# Altium schematic sheet ETH10M100M_RMII_LAN8720.SchDoc
size A3
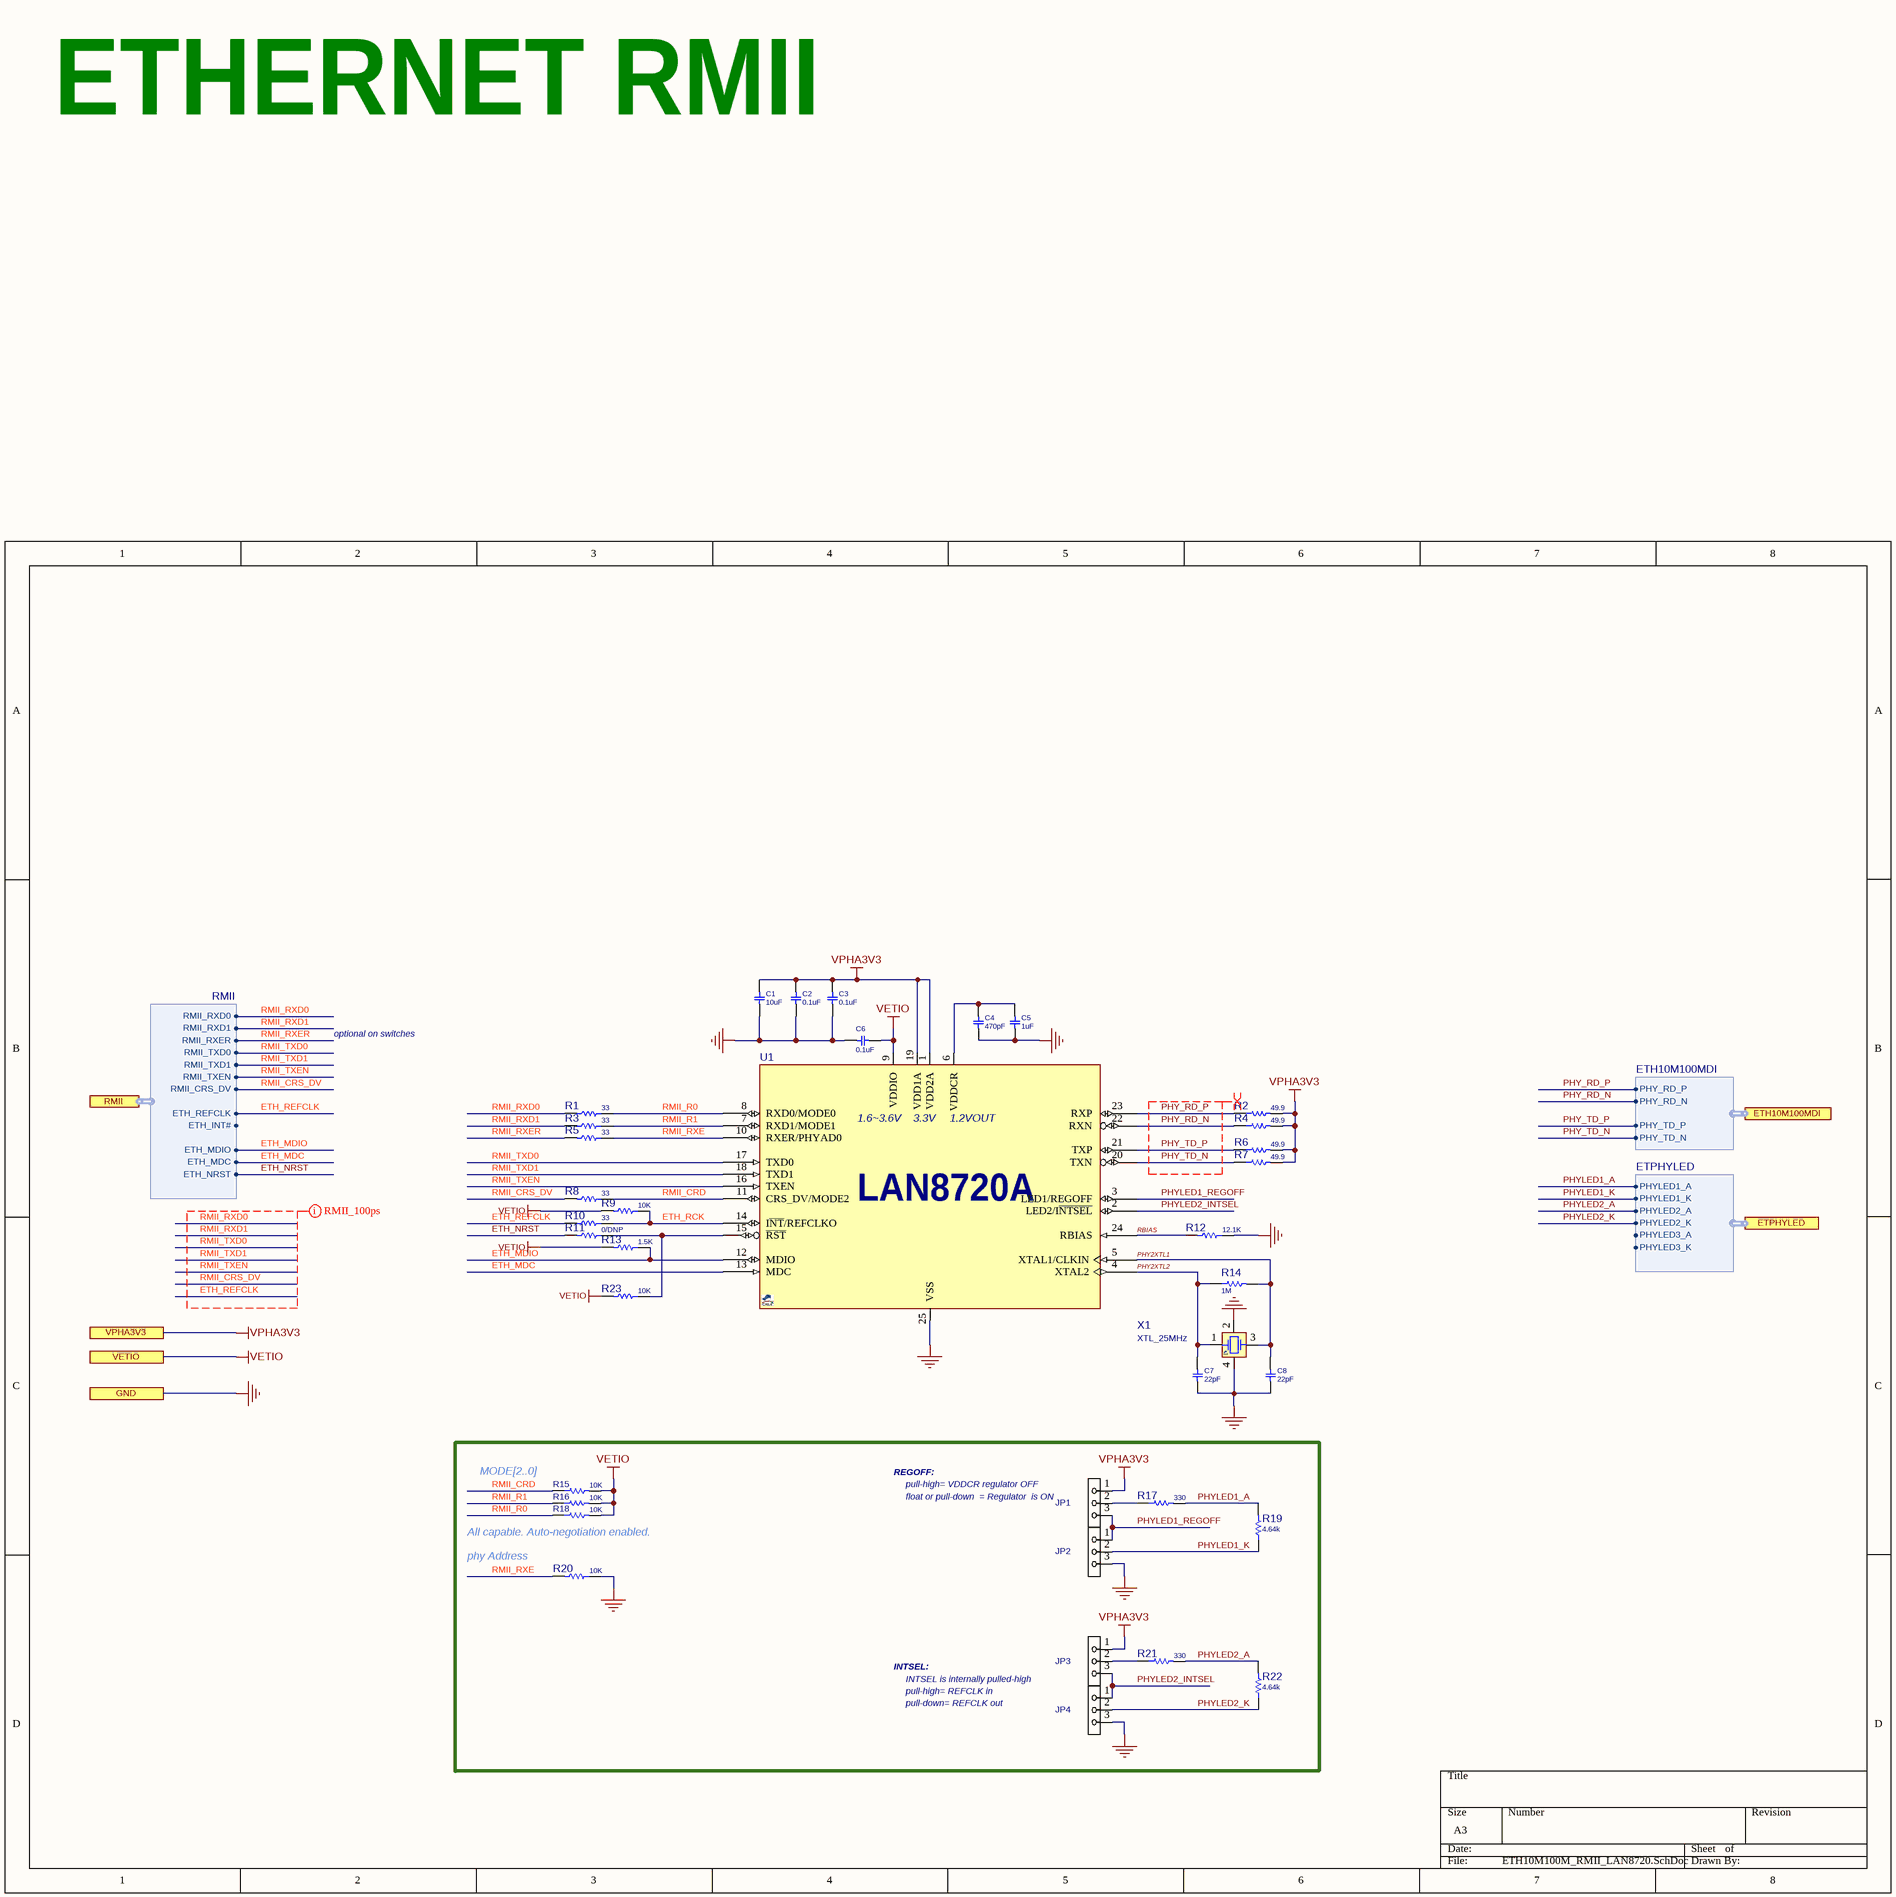
[diagram p0: ETH10M100M_RMII_LAN8720.SchDoc]

## Parts
C1  10uF  [C0402]
C2  0.1uF  [C0402]
C3  0.1uF  [C0402]
C4  470pF  [C0402]
C5  1uF  [C0402]
C6  0.1uF  [C0402]
C7  22pF  [C0402]
C8  22pF  [C0402]
JP1  JMPHDR3PIN  [JP_3_60W]  (value not drawn)
JP2  JMPHDR3PIN  [JP_3_60W]  (value not drawn)
JP3  JMPHDR3PIN  [JP_3_60W]  (value not drawn)
JP4  JMPHDR3PIN  [JP_3_60W]  (value not drawn)
R1  33  [R0402]
R2  49.9  [R0402]
R3  33  [R0402]
R4  49.9  [R0402]
R5  33  [R0402]
R6  49.9  [R0402]
R7  49.9  [R0402]
R8  33  [R0402]
R9  10K  [R0402]
R10  33  [R0402]
R11  0/DNP  [R0402]
R12  12.1K  [R0402]
R13  1.5K  [R0402]
R14  1M  [R0402]
R15  10K  [R0402]
R16  10K  [R0402]
R17  330  [R0402]
R18  10K  [R0402]
R19  4.64k  [R0402]
R20  10K  [R0402]
R21  330  [R0402]
R22  4.64k  [R0402]
R23  10K  [R0402]
U1  LAN8720A  [QFN50_24T]  (value not drawn)
X1  XTL_25MHz  [XTL_4_3225]

## Ports
ETH10M100MDI (harness ETH10M100MDI), ETPHYLED (harness ETPHYLED), GND, RMII (harness RMII), VETIO, VPHA3V3

## Harnesses
ETH10M100MDI: PHY_RD_P, PHY_RD_N, PHY_TD_P, PHY_TD_N
ETPHYLED: PHYLED1_A, PHYLED1_K, PHYLED2_A, PHYLED2_K, PHYLED3_A, PHYLED3_K
RMII: RMII_RXD0, RMII_RXD1, RMII_TXD0, RMII_TXD1, RMII_TXEN, RMII_CRS_DV, ETH_REFCLK, ETH_MDIO, ETH_MDC, ETH_NRST, RMII_RXER, ETH_INT#

## Nets
GND: C1.2 C2.2 C3.2 C4.2 C5.2 C6.2 C7.2 C8.2 JP2.3 JP4.3 R12.1 R20.1 U1.25(VSS) X1.2(GND1) X1.4(GND2) ; port GND
VETIO: C6.1 R9.2 R13.2 R15.2 R16.2 R18.2 R23.2 U1.9(VDDIO) ; port VETIO
VPHA3V3: C1.1 C2.1 C3.1 JP1.1 JP3.1 R2.2 R4.2 R6.2 R7.2 U1.1(VDD2A) U1.19(VDD1A) ; port VPHA3V3
ETH_MDC: U1.13(MDC) ; port RMII.ETH_MDC
ETH_MDIO: R13.1 U1.12(MDIO) ; port RMII.ETH_MDIO
ETH_NRST: R11.2 ; port RMII.ETH_NRST
ETH_RCK: R9.1 R10.1 U1.14(I~{NT}/REFCLKO)
ETH_REFCLK: R10.2 ; port RMII.ETH_REFCLK
PHY2XTL1: C8.1 R14.2 U1.5(XTAL1/CLKIN) X1.3(XB)
PHY2XTL2: C7.1 R14.1 U1.4(XTAL2) X1.1(XA)
PHY_RD_N: R4.1 U1.22(RXN) ; port ETH10M100MDI.PHY_RD_N
PHY_RD_P: R2.1 U1.23(RXP) ; port ETH10M100MDI.PHY_RD_P
PHY_TD_N: R7.1 U1.20(TXN) ; port ETH10M100MDI.PHY_TD_N
PHY_TD_P: R6.1 U1.21(TXP) ; port ETH10M100MDI.PHY_TD_P
PHYLED1_A: R17.2 R19.2 ; port ETPHYLED.PHYLED1_A
PHYLED1_K: JP2.2 R19.1 ; port ETPHYLED.PHYLED1_K
PHYLED1_REGOFF: JP1.3 JP2.1 U1.3(LED1/REGOFF)
PHYLED2_A: R21.2 R22.2 ; port ETPHYLED.PHYLED2_A
PHYLED2_INTSEL: JP3.3 JP4.1 U1.2(LED2/I~{NTSEL})
PHYLED2_K: JP4.2 R22.1 ; port ETPHYLED.PHYLED2_K
RBIAS: R12.2 U1.24(RBIAS)
RMII_CRD: R8.1 R15.1 U1.11(CRS_DV/MODE2)
RMII_CRS_DV: R8.2 ; port RMII.RMII_CRS_DV
RMII_R0: R1.1 R18.1 U1.8(RXD0/MODE0)
RMII_R1: R3.1 R16.1 U1.7(RXD1/MODE1)
RMII_RXD0: R1.2 ; port RMII.RMII_RXD0
RMII_RXD1: R3.2 ; port RMII.RMII_RXD1
RMII_RXE: R5.1 R20.2 U1.10(RXER/PHYAD0)
RMII_RXER: R5.2 ; port RMII.RMII_RXER
RMII_TXD0: U1.17(TXD0) ; port RMII.RMII_TXD0
RMII_TXD1: U1.18(TXD1) ; port RMII.RMII_TXD1
RMII_TXEN: U1.16(TXEN) ; port RMII.RMII_TXEN
NetC4_1: C4.1 C5.1 U1.6(VDDCR)
NetJP1_2: JP1.2 R17.1
NetJP3_2: JP3.2 R21.1
NetR11_1: R11.1 R23.1 U1.15(~{RST})

## Layout directives
net class RMII: ETH_REFCLK, RMII_CRS_DV, RMII_RXD0, RMII_RXD1, RMII_TXD0, RMII_TXD1, RMII_TXEN
differential pair: PHY_RD_N, PHY_RD_P, PHY_TD_N, PHY_TD_P

## Notes on the sheet
- ETHERNET RMII
- optional on switches
- MODE[2..0]
- REGOFF:
- pull-high= VDDCR regulator OFF
- (near R18) All capable. Auto-negotiation enabled.
- (near JP1) float or pull-down  = Regulator  is ON
- phy Address
- INTSEL:
- INTSEL is internally pulled-high
- pull-high= REFCLK in
- pull-down= REFCLK out
- (in symbol LAN8720A_QFN24) 1.6~3.6V; 3.3V; 1.2VOUT

## Library data of the parts
C1-C8 = CAP_SMD_MLCC_100n50TDK: CAP, MLCC; PARAM2: 50V; PARAM: -; MANF_P#: -; MANF: -; ASSEMBLY: ASSEMBLY; PRICE: -
  C1: VALUE: 10uF
  C2 C3 C6: VALUE: 0.1uF
  C4: VALUE: 470pF
  C5: VALUE: 1uF
  C7 C8: VALUE: 22pF
JP1-JP4 = JUMPER_SOLDER_3P: JUMPER, HEADER 3PIN; MANF: MANF; MANF_P#: MANF_P#; VALUE: JMPHDR3PIN
R1-R13 R15-R23 = RES_SMD_1K_0402YK: RESISTOR, SMD, THICK FILM, YAGEO; MANF_P#: RC0402FR-071KL; PARAM: 0.063W; DESC: DESCRIPTION; DIST#: MOUSER; PARAM2: 1%; MANF: Yageo; ASSEMBLY: ASSEMBLY; PRICE: 100= 0.3$
  R1 R3 R5 R8 R10: VALUE: 33
  R2 R4 R6 R7: VALUE: 49.9
  R9 R15 R16 R18 R20 R23: VALUE: 10K
  R11: VALUE: 0/DNP
  R12: VALUE: 12.1K
  R13: VALUE: 1.5K
  R17 R21: VALUE: 330
  R19 R22: VALUE: 4.64k
R14 = RES_SMD_10K_0402: RESISTOR, SMD; MANF: Yageo; PARAM: 0.063W; DESC: DESCRIPTION; DIST#: MOUSER; PARAM2: 1%; MANF_P#: RC0402FR-071ML; ASSEMBLY: ASSEMBLY; PRICE: 100= 0.8$; VALUE: 1M
U1 = LAN8720A_QFN24: Ethernet Transceiver, 10/100, RMII, 1.6-3.6V QFN24; MANF: SMSC; MANF_P#: LAN8720A-CP-TR; PARAM2: 1.6-3.6V; VALUE: LAN8720A
X1 = XTL_4_25MHz_3225: CRYSTAL 25.00 MHZ 18pF, 10PPM; MANF: EPSON; DESC: DESCRIPTION; DIST#: MOUSER; PARAM2: PARAM; MANF_P#: TSX-3225 25.0000MF10P-C3; ASSEMBLY: ASSEMBLY; PARAM: 10PPM; PRICE: 0.5$; VALUE: XTL_25MHz